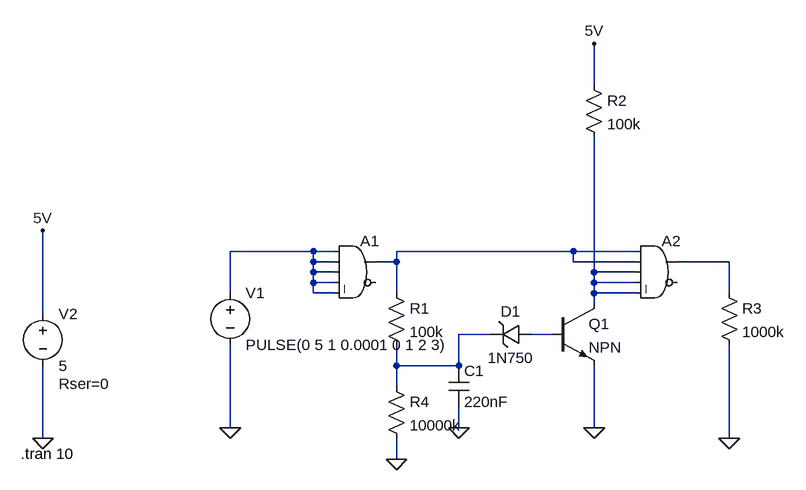
[diagram p0: schematic Wake-Pulse-Generator.asc]
Wake-Pulse-Generator.asc, the LTspice schematic file:
Version 4
SHEET 1 880 680
WIRE 416 -176 416 -240
WIRE -16 80 -144 80
WIRE 16 80 -16 80
WIRE 384 80 112 80
WIRE 480 80 384 80
WIRE -16 96 -16 80
WIRE 16 96 -16 96
WIRE 112 96 112 80
WIRE 112 96 80 96
WIRE 384 96 384 80
WIRE 480 96 384 96
WIRE 624 96 544 96
WIRE -16 112 -16 96
WIRE 16 112 -16 112
WIRE 416 112 416 -96
WIRE 480 112 416 112
WIRE -16 128 -16 112
WIRE 16 128 -16 128
WIRE 416 128 416 112
WIRE 480 128 416 128
WIRE -144 144 -144 80
WIRE -16 144 -16 128
WIRE 16 144 -16 144
WIRE 112 144 112 96
WIRE 416 144 416 128
WIRE 480 144 416 144
WIRE 624 144 624 96
WIRE 416 160 416 144
WIRE -432 176 -432 48
WIRE 256 208 208 208
WIRE 352 208 320 208
WIRE 112 256 112 224
WIRE 208 256 208 208
WIRE 208 256 112 256
WIRE 112 288 112 256
WIRE -144 352 -144 224
WIRE 208 352 208 320
WIRE 416 352 416 256
WIRE -432 368 -432 256
WIRE 624 368 624 224
WIRE 112 400 112 368
FLAG 208 352 0
FLAG 416 352 0
FLAG -144 352 0
FLAG -432 368 0
FLAG -432 48 5V
FLAG 416 -240 5V
FLAG 624 368 0
FLAG 112 400 0
SYMBOL Digital\\and 48 48 R0
SYMATTR InstName A1
SYMATTR SpiceLine Vhigh=5V
SYMBOL Digital\\and 512 48 R0
SYMATTR InstName A2
SYMATTR SpiceLine Vhigh=5V
SYMBOL cap 192 256 R0
SYMATTR InstName C1
SYMATTR Value 220nF
SYMBOL zener 320 192 R90
WINDOW 0 -4 32 VBottom 2
WINDOW 3 36 32 VTop 2
SYMATTR InstName D1
SYMATTR Value 1N750
SYMBOL npn2 352 160 R0
SYMATTR InstName Q1
SYMBOL voltage -144 128 R0
WINDOW 123 0 0 Left 0
WINDOW 39 0 0 Left 0
SYMATTR InstName V1
SYMATTR Value PULSE(0 5 1 0.0001 0 1 2 3)
SYMBOL res 96 128 R0
SYMATTR InstName R1
SYMATTR Value 100k
SYMBOL voltage -432 160 R0
WINDOW 123 0 0 Left 0
WINDOW 39 24 124 Left 2
SYMATTR InstName V2
SYMATTR Value 5
SYMATTR SpiceLine Rser=0
SYMBOL res 400 -192 R0
SYMATTR InstName R2
SYMATTR Value 100k
SYMBOL res 608 128 R0
SYMATTR InstName R3
SYMATTR Value 1000k
SYMBOL res 96 272 R0
SYMATTR InstName R4
SYMATTR Value 10000k
TEXT -466 392 Left 2 !.tran 10

The netlist it stands for:
* Wake-Pulse-Generator.asc
A1 N001 N001 N001 N001 N001 0 N002 0 AND Vhigh=5V
A2 N002 N002 N004 N004 N004 0 N003 0 AND Vhigh=5V
C1 N005 0 220nF
D1 N006 N005 1N750
Q1 N004 N006 0 0 NPN
V1 N001 0 PULSE(0 5 1 0.0001 0 1 2 3)
R1 N002 N005 100k
V2 5V 0 5 Rser=0
R2 5V N004 100k
R3 N003 0 1000k
R4 N005 0 10000k
.model D D
.lib standard.dio
.model NPN NPN
.model PNP PNP
.lib standard.bjt
.tran 10
.backanno
.end